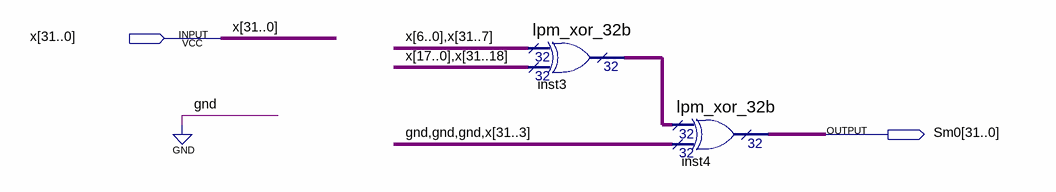
[diagram p0: schematic sheet]
// Quartus schematic Sm0.bdf as structural Verilog: 2 symbols, 2 pins
module Sm0 (
  input  [31:0] x,
  output [31:0] Sm0
);

  wire [31:0] inst3_result;

  lpm_xor_32b inst3 (.data0x({x[6:0], x[31:7]}), .data1x({x[17:0], x[31:18]}), .result(inst3_result));
  lpm_xor_32b inst4 (.data0x(inst3_result), .data1x({3'b000, x[31:3]}), .result(Sm0));
endmodule
